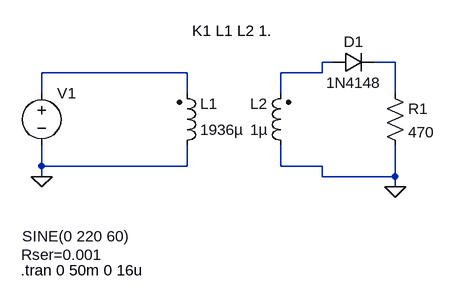
[diagram p0: schematic Grampeador.asc]
Grampeador.asc, the LTspice schematic file:
Version 4
SHEET 1 880 680
WIRE 496 80 480 80
WIRE 592 80 560 80
WIRE 272 96 48 96
WIRE 480 96 480 80
WIRE 480 96 416 96
WIRE 48 128 48 96
WIRE 272 128 272 96
WIRE 416 128 416 96
WIRE 592 128 592 80
WIRE 48 240 48 208
WIRE 272 240 272 208
WIRE 272 240 48 240
WIRE 416 240 416 208
WIRE 480 240 416 240
WIRE 48 256 48 240
WIRE 480 256 480 240
WIRE 592 256 592 208
WIRE 592 256 480 256
WIRE 592 272 592 256
FLAG 592 272 0
FLAG 48 256 0
SYMBOL voltage 48 112 R0
WINDOW 123 0 0 Left 0
WINDOW 39 -31 264 Left 2
WINDOW 3 -30 236 Left 2
SYMATTR SpiceLine Rser=0.001
SYMATTR InstName V1
SYMATTR Value SINE(0 220 60)
SYMBOL diode 496 96 R270
WINDOW 0 32 32 VTop 2
WINDOW 3 0 32 VBottom 2
SYMATTR InstName D1
SYMATTR Value 1N4148
SYMBOL res 576 112 R0
SYMATTR InstName R1
SYMATTR Value 470
SYMBOL ind2 256 224 M180
WINDOW 0 36 80 Left 2
WINDOW 3 36 40 Left 2
SYMATTR InstName L1
SYMATTR Value 1936µ
SYMBOL ind2 432 224 R180
WINDOW 0 36 80 Left 2
WINDOW 3 36 40 Left 2
SYMATTR InstName L2
SYMATTR Value 1µ
TEXT 280 32 Left 2 !K1 L1 L2 1.
TEXT 16 400 Left 2 !.tran 0 50m 0 16u

The netlist it stands for:
* Grampeador.asc
V1 N003 0 SINE(0 220 60) Rser=0.001
D1 N001 N002 1N4148
R1 N002 0 470
L1 0 N003 1936µ
L2 0 N001 1µ
.model D D
.lib standard.dio
K1 L1 L2 1.
.tran 0 50m 0 16u
.backanno
.end